# Altium schematic sheet 780-00057, rev1, Pg1, SCH, NRES, Crate Slot MotherBoard.SchDoc
size B
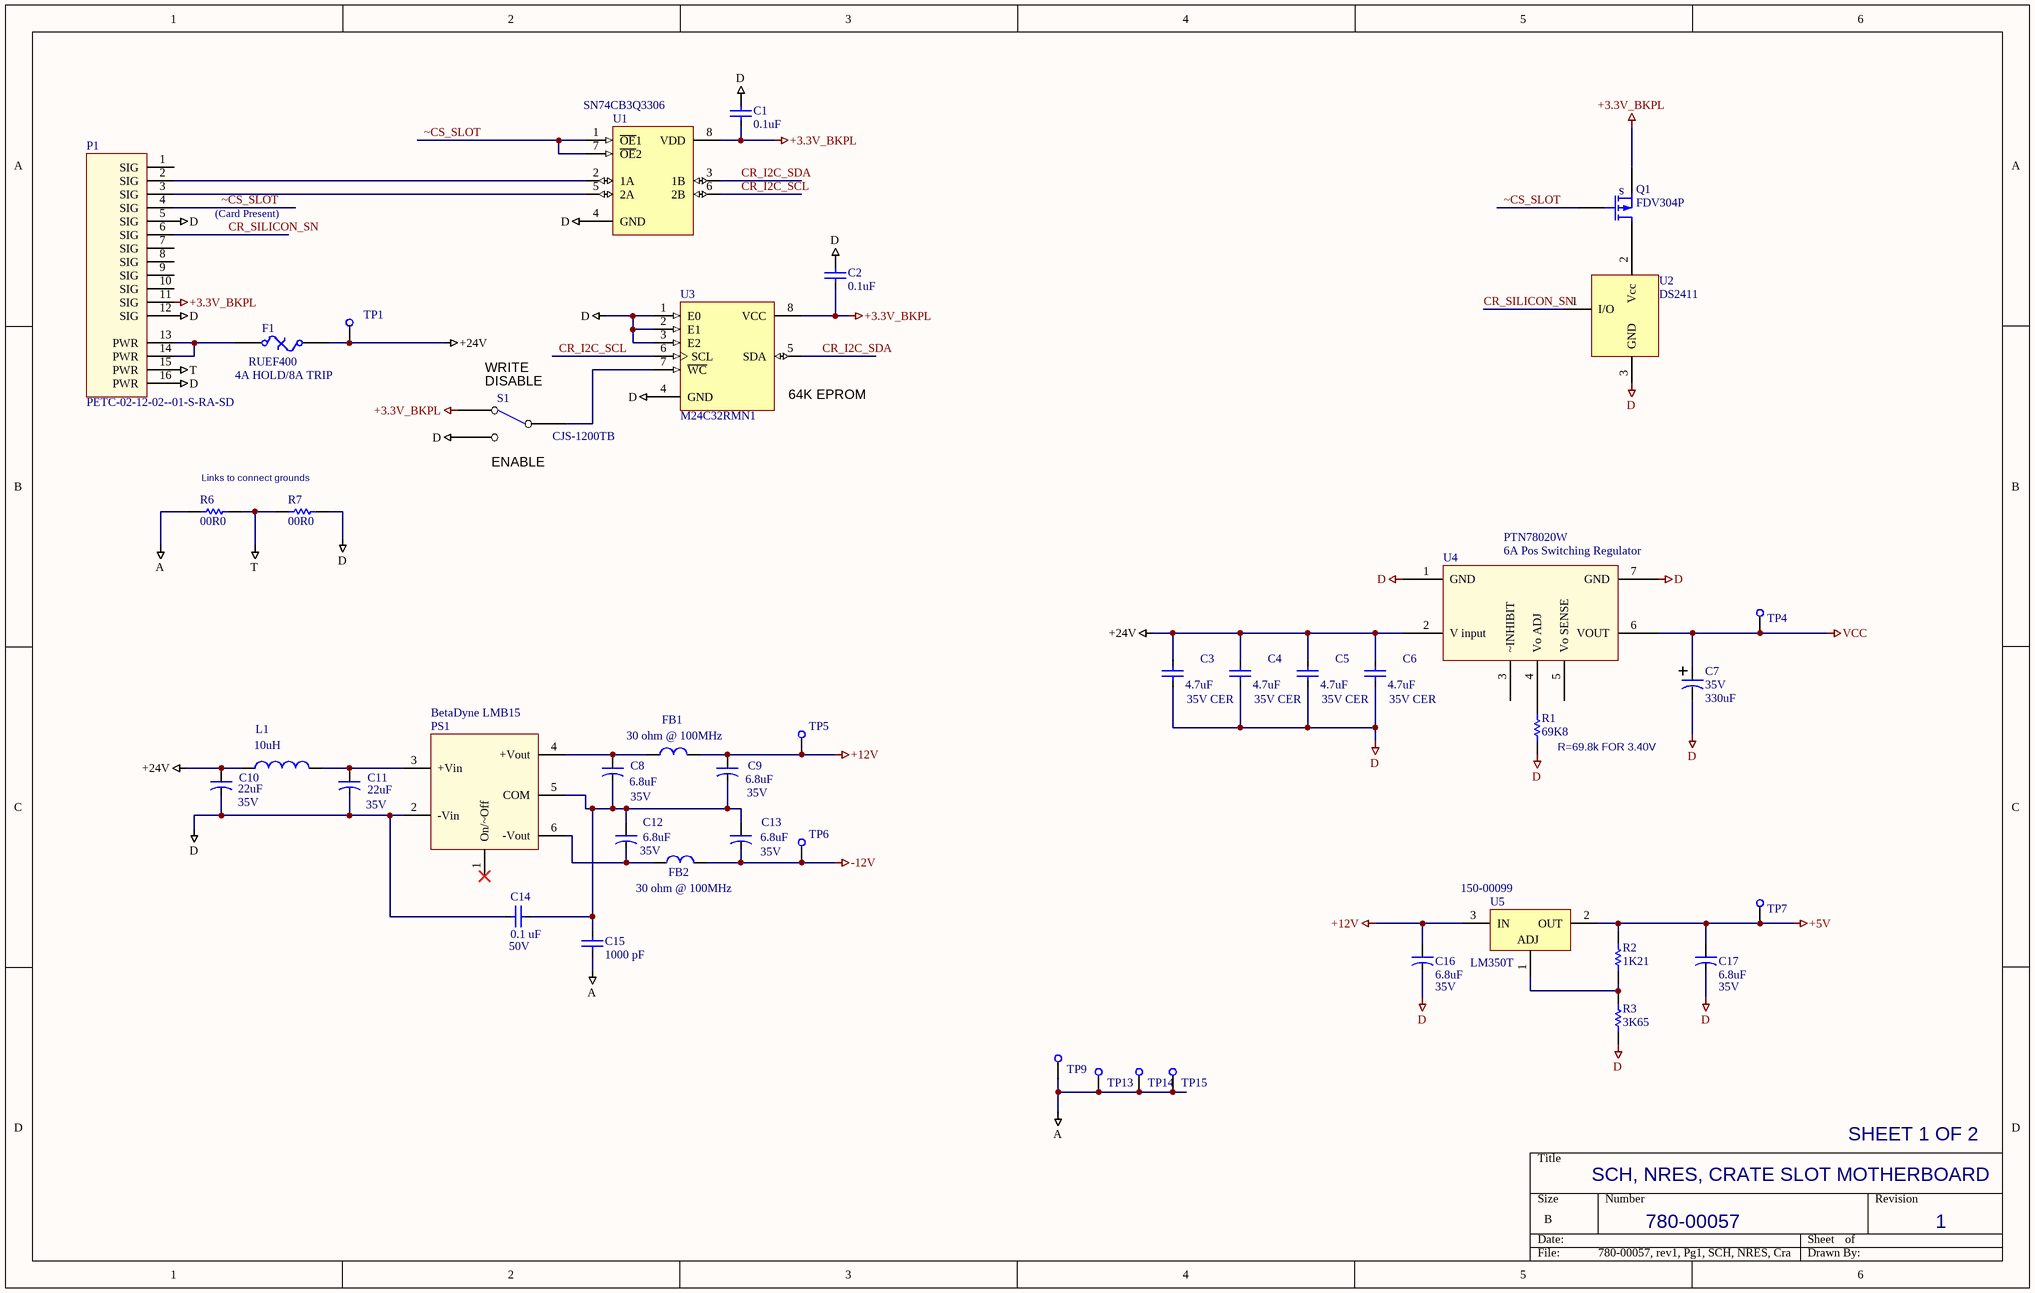
[diagram p0: 780-00057, rev1, Pg1, SCH, NRES, Crate Slot MotherBoard.SchDoc]

## Parts
C1  value 0.1uF  [SMD_0805]  (hidden comment: Cap SMD)
C2  value 0.1uF  [SMD_0805]  (hidden comment: Cap SMD)
C3  35V CER  value 4.7uF  [SMD_0805]
C4  35V CER  value 4.7uF  [SMD_0805]
C5  35V CER  value 4.7uF  [SMD_0805]
C6  35V CER  value 4.7uF  [SMD_0805]
C7  35V  value 330uF  [CAP, Thru Hole 10mm dia]
C8  35V  value 6.8uF  [SMD_CAP_6032]
C9  35V  value 6.8uF  [SMD_CAP_6032]
C10  35V  value 22uF  [SMD_CAP_7343]
C11  35V  value 22uF  [SMD_CAP_7343]
C12  35V  value 6.8uF  [SMD_CAP_6032]
C13  35V  value 6.8uF  [SMD_CAP_6032]
C14  50V  value 0.1 uF  [SMD_0805]
C15  value 1000 pF  [SMD_0805]  (hidden comment: Cap SMD)
C16  35V  value 6.8uF  [SMD_CAP_6032]
C17  35V  value 6.8uF  [SMD_CAP_6032]
F1  RUEF400  value 4A HOLD/8A TRIP  [PolySwitch Radial 0.2]
FB1  value 30 ohm @ 100MHz  [SMD_1210_INDUCT]  (hidden comment: Bead)
FB2  value 30 ohm @ 100MHz  [SMD_1210_INDUCT]  (hidden comment: Bead)
L1  value 10uH  [Inductor TDC SLF]  (hidden comment: 445-3869-1-ND)
P1  PETC-02-12-02--01-S-RA-SD  [PETC-02-12-02-01-RA]
PS1  BetaDyne LMB15  [BetaDyne LNB15, DC/DC]
Q1  FDV304P  [SMD_SOT23_3]
R1  value 69K8  [SMD_0805]  (hidden comment: Res 0805)
R2  value 1K21  [SMD_0805]  (hidden comment: Res 0805)
R3  value 3K65  [SMD_0805]  (hidden comment: Res 0805)
R6  value 00R0  [smd_0805]  (hidden comment: Res 0805)
R7  value 00R0  [smd_0805]  (hidden comment: Res 0805)
S1  CJS-1200TB  [CAS-120B]
TP1  Test point  [PAD_80D_052H]  (value not drawn)
TP4  Test point  [PAD_80D_052H]  (value not drawn)
TP5  Test point  [PAD_80D_052H]  (value not drawn)
TP6  Test point  [PAD_80D_052H]  (value not drawn)
TP7  Test point  [PAD_80D_052H]  (value not drawn)
TP9  Test point  [PAD_80D_052H]  (value not drawn)
TP13  Test point  [PAD_80D_052H]  (value not drawn)
TP14  Test point  [PAD_80D_052H]  (value not drawn)
TP15  Test point  [PAD_80D_052H]  (value not drawn)
U1  value SN74CB3Q3306  [PW008_N]  (hidden comment: SN74CBT3306PWLE)
U2  DS2411  [SMD_SOT23_3]
U3  M24C32RMN1  [SOP8_N]
U4  6A Pos Switching Regulator  value PTN78020W  [TEXAS Inst Switching Regulator]
U5  LM350T  LCO p/n: 150-00099  [TO-220AB]

## Nets
+3.3V_BKPL: C1.1 C2.1 P1.11(SIG) Q1.2(S) S1.3(NC) U1.8(VDD) U3.8(VCC)
+5V: C17.pos R2.2 TP7.1(TP) U5.2(OUT)
+12V: C9.pos C16.pos FB1.2 TP5.1(TP) U5.3(IN)
+24V: C3.2 C4.2 C5.2 C6.2 C10.pos F1.2 L1.1 TP1.1(TP) U4.2(V_input)
-12V: C13.neg FB2.2 TP6.1(TP)
A: C15.1 R6.1 TP9.1(TP) TP13.1(TP) TP14.1(TP) TP15.1(TP)
D: C1.2 C2.2 C3.1 C4.1 C5.1 C6.1 C7.2 C10.neg C11.neg C14.1 C16.neg C17.neg P1.5(SIG) P1.12(SIG) P1.16(PWR) PS1.2(-Vin) R1.1 R3.1 R7.2 S1.1(NO) U1.4(GND) U2.3(GND) U3.1(E0) U3.2(E1) U3.3(E2) U3.4(GND) U4.1(GND) U4.7(GND)
T: P1.15(PWR) R6.2 R7.1
VCC: C7.1 TP4.1(TP) U4.6(VOUT)
CR_I2C_SCL: U1.6(2B) U3.6(SCL)
CR_I2C_SDA: U1.3(1B) U3.5(SDA)
CR_SILICON_SN: P1.6(SIG) U2.1(I/O)
~CS_SLOT: P1.4(SIG) Q1.1(G) U1.1(~{OE}1) U1.7(~{OE}2)
NetC8_neg: C8.neg C9.neg C12.pos C13.pos C14.2 C15.2 PS1.5(COM)
NetC8_pos: C8.pos FB1.1 PS1.4(+Vout)
NetC11_pos: C11.pos L1.2 PS1.3(+Vin)
NetC12_neg: C12.neg FB2.1 PS1.6(-Vout)
NetF1_1: F1.1 P1.13(PWR) P1.14(PWR)
NetP1_2: P1.2(SIG) U1.2(1A)
NetP1_3: P1.3(SIG) U1.5(2A)
NetQ1_3: Q1.3(D) U2.2(Vcc)
NetR1_2: R1.2 U4.4(Vo_ADJ)
NetR2_1: R2.1 R3.2 U5.1(ADJ)
NetS1_2: S1.2(COM) U3.7(~{WC})

Not connected (* = marked no-connect by the designer): P1 1(SIG) 7(SIG) 8(SIG) 9(SIG) 10(SIG); PS1 1(On/~Off)*; U4 3(~INHIBIT) 5(Vo_SENSE)

## Notes on the sheet
- (Card Present)
- (near S1) WRITE
- (near S1) DISABLE
- (near U3) 64K EPROM
- Links to connect grounds
- (near S1) ENABLE
- (near R1) R=69.8k FOR 3.40V
- SCH, NRES, CRATE SLOT MOTHERBOARD
- SHEET 1 OF 2
- 780-00057
- 1
- (in symbol FDV304P) s

## Library data of the parts
C1 C2 = Cap SMD: Capacitor; Manufacturer: AVX; Manuf p/n: 08055C104KAT2A; Vendor: DigiKey; Vendor p/n: 478-1395-1-ND; Vendor Mult.: 10; LCO P/N: 120-00002; COST: 0.088
C3-C6 = Cap SMD: Capacitor; LCO p/n: 120-00051
C7 = Cap Elec, 330 uF, 35V: Radial Thru hole; LCO p/n: 120-00053
C8 C9 C12 C13 = Cap Tant 35V: outline 6.0mm x 3.2mm; LCO p/n: 120-00010
C10 C11 = Cap Tant 35V: outline 6.0mm x 3.2mm; Manufacturer: Kemet; Manuf p/n: B45197A6226K409; Vendor: Digi-Key; Vendor p/n: 495-1582-1-ND; Vendor Mult.: 1; LCO p/n: 120-00046; COST: 1.32
C14 = Cap SMD: Capacitor; LCO p/n: 120-00002
C15 = Cap SMD: Capacitor; LCO p/n: 120-00033
C16 C17 = Cap Tant 35V: outline 6.0mm x 3.2mm; Manufacturer: NICHICON; Manuf p/n: F911V685MCC; Vendor: DigiKey; Vendor p/n: 493-2325-1-ND; Vendor Mult.: 1; LCO P/N: 120-00010; COST: 1.55
F1 = Fuse Thermal: PolySwitch RUE Series; Manufacturer: Tyco Electronics; Vendor: DIGIKEY; Vendor Mult.: 1; Vendor p/n: RUEF400-ND; LCO p/n: 145-00003; COST: 0.50; Manuf p/n: RUEF400
FB1 FB2 = Ferrite Bead SMD 1210: Ferrite Bead  SMD 1210; Manufacturer: Wurth; Manuf p/n: 742792310; Vendor: Digi-Key; Vendor p/n: 732-1631-1-ND; Vendor Mult.: 1; LCO p/n: 155-00018; COST: 0.22
L1 = Inductor SMD 10uH 1.8A: Inductor; Manufacturer: TDK; Manuf p/n: SLF7045T-100M1R8-H; Vendor: Digi-Key; Vendor Mult.: 1; LCO p/n: 155-00015; Vendor p/n: 445-3869-1-ND
P1 = PETC-02-12-02--01-S-RA-SD: SAMTEC, SIGNAL(12)+PWR(4); LCO p/n: 125-00087; Vendor Mult.: 1; Manufacturer: SAMTEC; Manuf p/n: PETC-02-12-02--01-S-RA-SD; Vendor: SAMTEC; Vendor p/n: PETC-02-12-02--01-S-RA-SD
PS1 = BetaDyne LMB15: DC/DC LMB15 15W, Dual Output; LCO p/n: 170-00003
Q1 = FDV304P: P-MOSFET LOGIC LEVEL; Manufacturer: Fairchild; Vendor: DigiKey; Vendor p/n: FDV304PCT-ND; Vendor Mult.: 1; LCO P/N: 195-00004; COST: 0.46; Manuf p/n: FDV304P; Value: FDV304P
R1 = Res SMD: Resistor 0805; Manufacturer: Vishay/Dale; Manuf p/n: CRCW080569K8FKEA; Vendor: DIGIKEY; Vendor p/n: 541-69K8CCT-ND; Vendor Mult.: 10; LCO p/n: 181-06982; COST: 0.09
R2 = Res SMD: Resistor 0805; Manufacturer: Vishay/Dale; Manuf p/n: CRCW08051K21FKEA; Vendor: DIGIKEY; Vendor p/n: 541-1K21CCT-ND; Vendor Mult.: 10; LCO p/n: 181-01211; COST: 0.09
R3 = Res SMD: Resistor 0805; Manufacturer: Vishay/Dale; Manuf p/n: CRCW08053K65FKEA; Vendor: DIGIKEY; Vendor p/n: 541-3K65CCT-ND; Vendor Mult.: 10; LCO p/n: 181-03651; COST: 0.09
R6 R7 = Res SMD: Resistor 0805; Manufacturer: Vishay/Dale; Manuf p/n: CRCW080500R0FKEA; Vendor: DIGIKEY; Vendor p/n: 541-00R0CCT-ND; Vendor Mult.: 10; LCO p/n: 180-00033; COST: 0.09
S1 = SW_SPDT_DOUG: Manufacturer: Copal Electronics; Manuf p/n: CAS-120TB; Vendor: DIGIKEY; Vendor Mult.: 1; LCO p/n: 185-00010; COST: 1.27; Value: SW_SPDT
TP1 TP4-TP7 TP9 TP13-TP15 = Test point: Manufacturer: Keystone; Manuf p/n: 1249; Vendor: Bisco Ind.; LCO p/n: 125-00013; Vendor p/n: 1249; COST: 0.18; VALUE: Test point
U1 = SN74CBT3306PWLE: Dual FET Bus Switch; Manufacturer: TI; Manuf p/n: SN74CB3Q3306APWR; LCO p/n: 150-00083; Vendor: Digi-Key; Vendor Mult.: 1; Vendor p/n: 296-15102-1-ND; COST: 0.95
U2 = DS2411: Silicon Serial Number; Manufacturer: MAXIM; Manuf p/n: DS2411R+T&R; Vendor: DIGIKEY; Vendor p/n: DS2411R+CT-ND; Vendor Mult.: 1; LCO p/n: 150-00031; COST: 1.25; VALUE: DS2411
U3 = M24C32RMN1: 32 Kbit Serial I²C Bus EEPROM; LCO p/n: 150-00076
U4 = PTN78020W: Pos Adj Switching Regulator; LCO p/n: 150-00088
U5 = LM350T: 3-Amp Adjustable Regulator; Manufacturer: National Semiconductor; Value: LM350; Vendor: Digi-Key; Vendor Mult.: 1; Vendor p/n: LM350TFS-ND; Manuf p/n: LM350T